# EAGLE schematic komparator 8 (EAGLE 5.06)
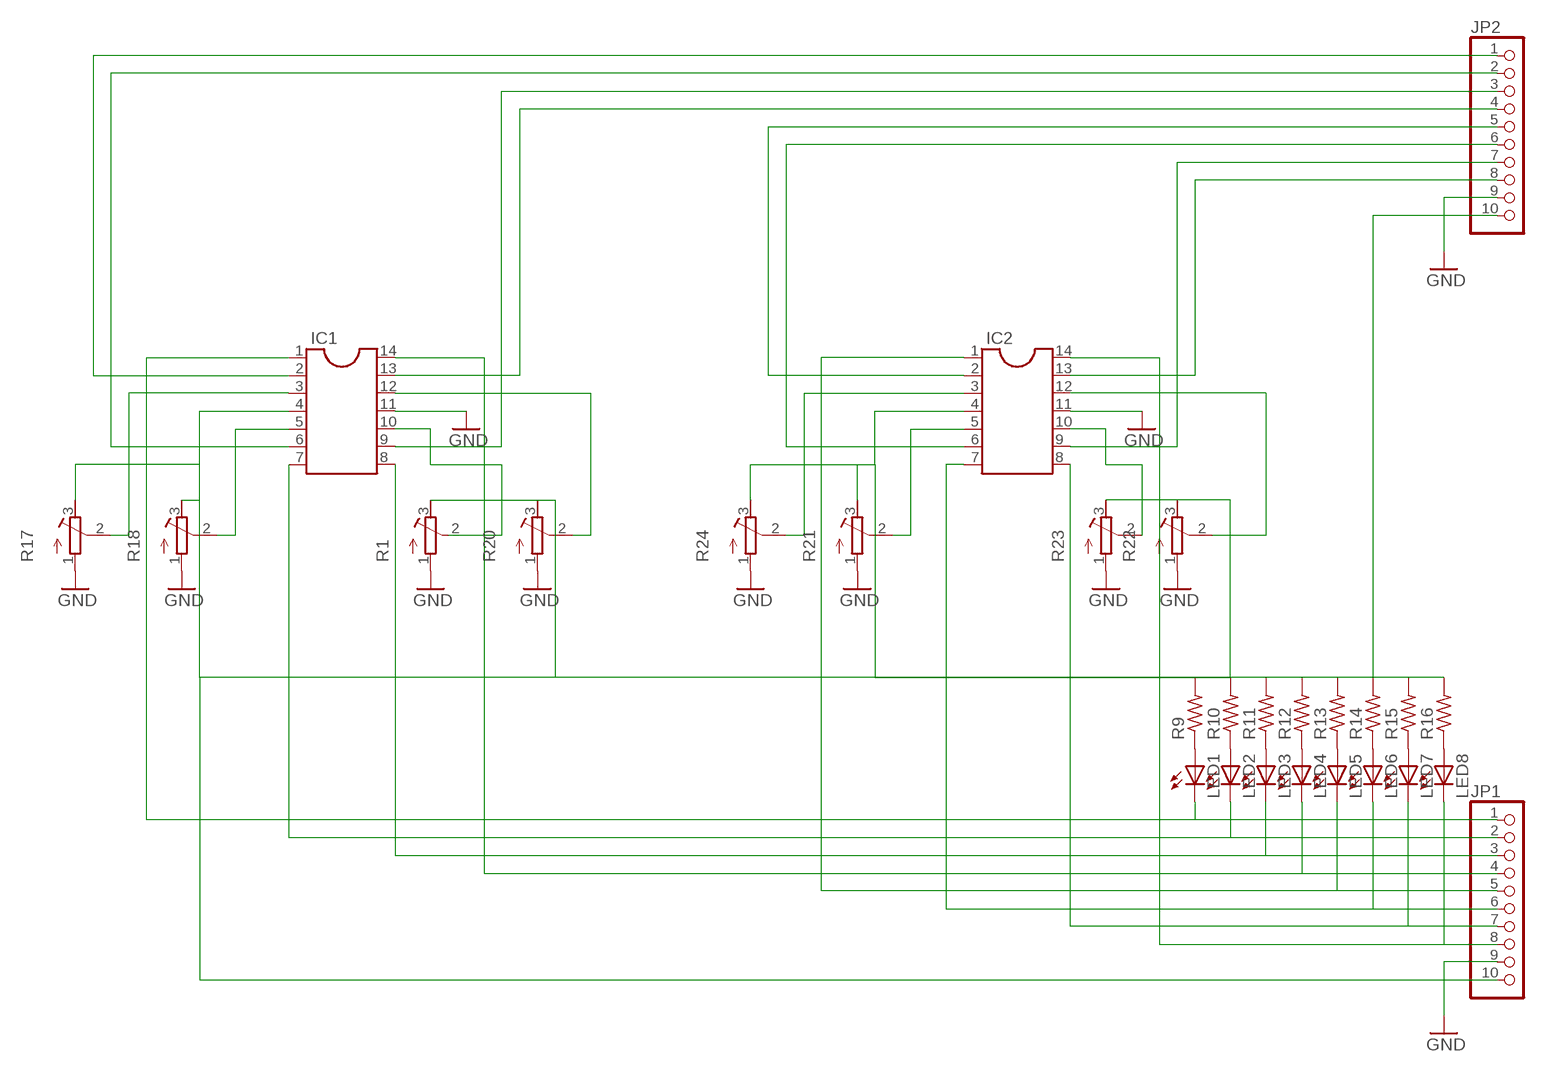
[diagram p0: schematic, sheet 1]

## Parts
IC1  DIL14  [DIL14]
IC2  DIL14  [DIL14]
JP1  PINHD-1X10  [1X10]
JP2  PINHD-1X10  [1X10]
LED1  LED5MM  [LED5MM]
LED2  LED5MM  [LED5MM]
LED3  LED5MM  [LED5MM]
LED4  LED5MM  [LED5MM]
LED5  LED5MM  [LED5MM]
LED6  LED5MM  [LED5MM]
LED7  LED5MM  [LED5MM]
LED8  LED5MM  [LED5MM]
R1  R-TRIMM3339P  [RTRIM3339P]
R9  R-US_0207/10  [0207/10]
R10  R-US_0207/10  [0207/10]
R11  R-US_0207/10  [0207/10]
R12  R-US_0207/10  [0207/10]
R13  R-US_0207/10  [0207/10]
R14  R-US_0207/10  [0207/10]
R15  R-US_0207/10  [0207/10]
R16  R-US_0207/10  [0207/10]
R17  R-TRIMM3339P  [RTRIM3339P]
R18  R-TRIMM3339P  [RTRIM3339P]
R20  R-TRIMM3339P  [RTRIM3339P]
R21  R-TRIMM3339P  [RTRIM3339P]
R22  R-TRIMM3339P  [RTRIM3339P]
R23  R-TRIMM3339P  [RTRIM3339P]
R24  R-TRIMM3339P  [RTRIM3339P]

## Nets
GND: IC1.11 IC2.11 JP1.9 JP2.9 R1.1(E) R17.1(E) R18.1(E) R20.1(E) R21.1(E) R22.1(E) R23.1(E) R24.1(E)
N$1: IC1.2 JP2.1
N$2: IC1.6 JP2.2
N$3: IC1.9 JP2.3
N$4: IC1.13 JP2.4
N$5: IC2.2 JP2.5
N$6: IC2.6 JP2.6
N$7: IC2.9 JP2.7
N$8: IC2.13 JP2.8
N$10: IC1.3 R17.2(S)
N$11: IC1.1 JP1.1 LED1.K(C)
N$14: IC1.5 R18.2(S)
N$15: IC1.7 JP1.2 LED2.K(C)
N$16: IC1.8 JP1.3 LED3.K(C)
N$17: IC1.10
N$19: IC1.14 JP1.4 LED4.K(C)
N$20: IC1.12 R20.2(S)
N$23: IC2.3 R24.2(S)
N$24: IC2.1 JP1.5 LED5.K(C)
N$26: IC2.5 R21.2(S)
N$27: IC2.7 JP1.6 LED6.K(C)
N$28: IC2.8 JP1.7 LED7.K(C)
N$29: IC2.10 R23.2(S)
N$32: IC2.12 R22.2(S)
N$33: IC2.14 JP1.8 LED8.K(C)
N$34: LED1.A R9.1
N$35: LED2.A R10.1
N$36: LED3.A R11.1
N$37: LED4.A R12.1
N$38: LED5.A R13.1
N$39: LED6.A R14.1
N$40: LED7.A R15.1
N$41: LED8.A R16.1
N$43: IC1.4 IC2.4 JP1.10 JP2.10 R1.3(A) R9.2 R10.2 R11.2 R12.2 R13.2 R14.2 R15.2 R16.2 R17.3(A) R18.3(A) R20.3(A) R21.3(A) R22.3(A) R23.3(A) R24.3(A)
Unconnected: R1.2(S)

## Library data of the parts
IC1 IC2 = ic-package:DIL14: Dual In Line / Socket
JP1 JP2 = pinhead:PINHD-1X10: PIN HEADER
LED1-LED8 = led:LED: LED OSRAM: - CHIPLED LG R971, LG N971, LY N971, LG Q971, LY Q971, LO R971, LY R971 LH N974, LH R974 LS Q976, LO Q976, LY Q976 LO Q996 - Hyper CHIPLED LW Q18S LB Q993, LB Q99A, LB R99A - SideLED LS A670, LO A670, LY A670, LG A670, LP A670 LB A673, LV A673, LT A673, LW A673 LH A674 LY A675 LS A676, LA A676, LO A676, LY A676, LW A676 LS A679, LY A679, LG A679 - Hyper Micro SIDELED® LS Y876, LA Y876, LO Y876, LY Y876 LT Y87S - SmartLED LW L88C, LW L88S LB L89C, LB L89S, LG L890 LS L89K, LO L89K, LY L89K LS L896, LA L896, LO L896, LY L896 - TOPLED LS T670, LO T670, LY T670, LG T670, LP T670 LSG T670, LSP T670, LSY T670, LOP T670, LYG T670 LG T671, LOG T671, LSG T671 LB T673, LV T673, LT T673, LW T673 LH T674 LS T676, LA T676, LO T676, LY T676, LB T676, LH T676, LSB T676, LW T676 LB T67C, LV T67C, LT T67C, LS T67K, LO T67K, LY T67K, LW E67C LS E67B, LA E67B, LO E67B, LY E67B, LB E67C, LV E67C, LT E67C LW T67C LS T679, LY T679, LG T679 LS T770, LO T770, LY T770, LG T770, LP T770 LB T773, LV T773, LT T773, LW T773 LH T774 LS E675, LA E675, LY E675, LS T675 LS T776, LA T776, LO T776, LY T776, LB T776 LHGB T686 LT T68C, LB T68C - Hyper Mini TOPLED® LB M676 - Mini TOPLED Santana® LG M470 LS M47K, LO M47K, LY M47K Source: http://www.osram.convergy.de LUXEON: - LUMILED® LXK2-PW12-R00, LXK2-PW12-S00, LXK2-PW14-U00, LXK2-PW14-V00 LXK2-PM12-R00, LXK2-PM12-S00, LXK2-PM14-U00 LXK2-PE12-Q00, LXK2-PE12-R00, LXK2-PE12-S00, LXK2-PE14-T00, LXK2-PE14-U00 LXK2-PB12-K00, LXK2-PB12-L00, LXK2-PB12-M00, LXK2-PB14-N00, LXK2-PB14-P00, LXK2-PB14-Q00 LXK2-PR12-L00, LXK2-PR12-M00, LXK2-PR14-Q00, LXK2-PR14-R00 LXK2-PD12-Q00, LXK2-PD12-R00, LXK2-PD12-S00 LXK2-PH12-R00, LXK2-PH12-S00 LXK2-PL12-P00, LXK2-PL12-Q00, LXK2-PL12-R00 Source: www.luxeon.com KINGBRIGHT: KA-3528ASYC Source: www.kingbright.com
R1 R17 R18 R20-R24 = resistor:R-TRIMM: Trimm resistor
R9-R16 = resistor:R-US_: RESISTOR, American symbol